# EAGLE design WSC2022SE_TP16_MA2_SPDIF_StartingPoint_ NO_RCA _JACK (EAGLE 9.7.0)

## Sheet 1 of 5
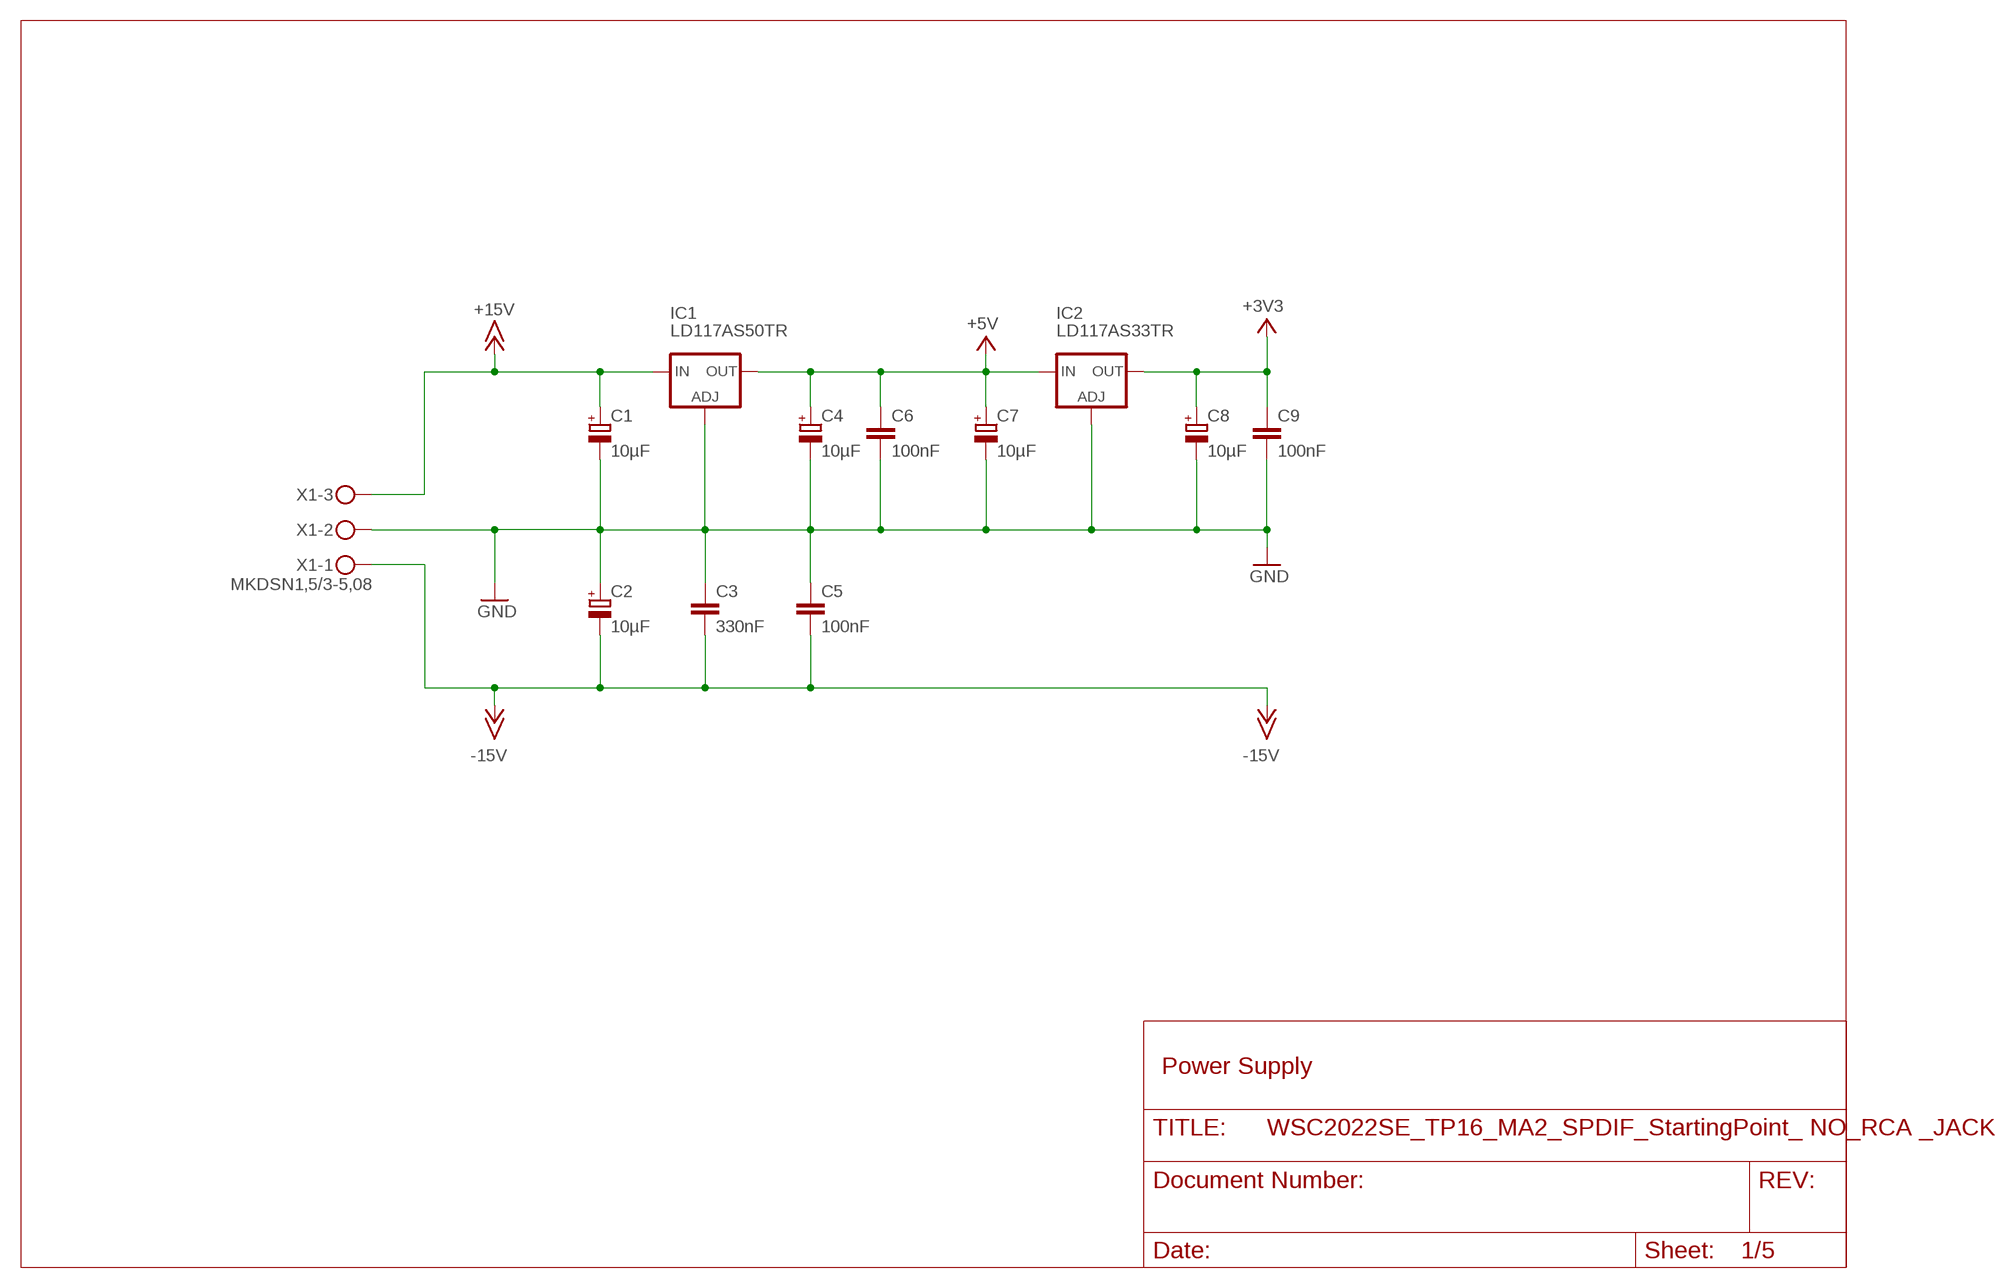
[diagram p0: schematic, sheet 1]

### Parts
C1  10µF  CPOL-EUCT3528  [CT3528]
C2  10µF  CPOL-EUCT3528  [CT3528]
C3  330nF  C-EUC0805  [C0805]
C4  10µF  CPOL-EUCT3528  [CT3528]
C5  100nF  C-EUC0805  [C0805]
C6  100nF  C-EUC0805  [C0805]
C7  10µF  CPOL-EUCT3528  [CT3528]
C8  10µF  CPOL-EUCT3528  [CT3528]
C9  100nF  C-EUC0805  [C0805]
IC1  LD117AS50TR  [SOT223]
IC2  LD117AS33TR  LD117AS50TR  [SOT223]
X1  MKDSN1,5/3-5,08  [MKDSN1,5/3-5,08]

### Nets
+3V3: C8.+ C9.1 IC2.2(OUT) IC2.4(OUT) ; also sheet 2,3
+5V: C4.+ C6.1 C7.+ IC1.2(OUT) IC1.4(OUT) IC2.3(IN) ; also sheet 3
+15V: C1.+ IC1.3(IN) X1.3 ; also sheet 4,5
-15V: C2.- C3.2 C5.2 X1.1 ; also sheet 4,5
GND: C1.- C2.+ C3.1 C4.- C5.1 C6.2 C7.- C8.- C9.2 IC1.1(ADJ) IC2.1(ADJ) X1.2 ; also sheet 2,3,4,5

### Notes on the sheet
- Power Supply

## Sheet 2 of 5
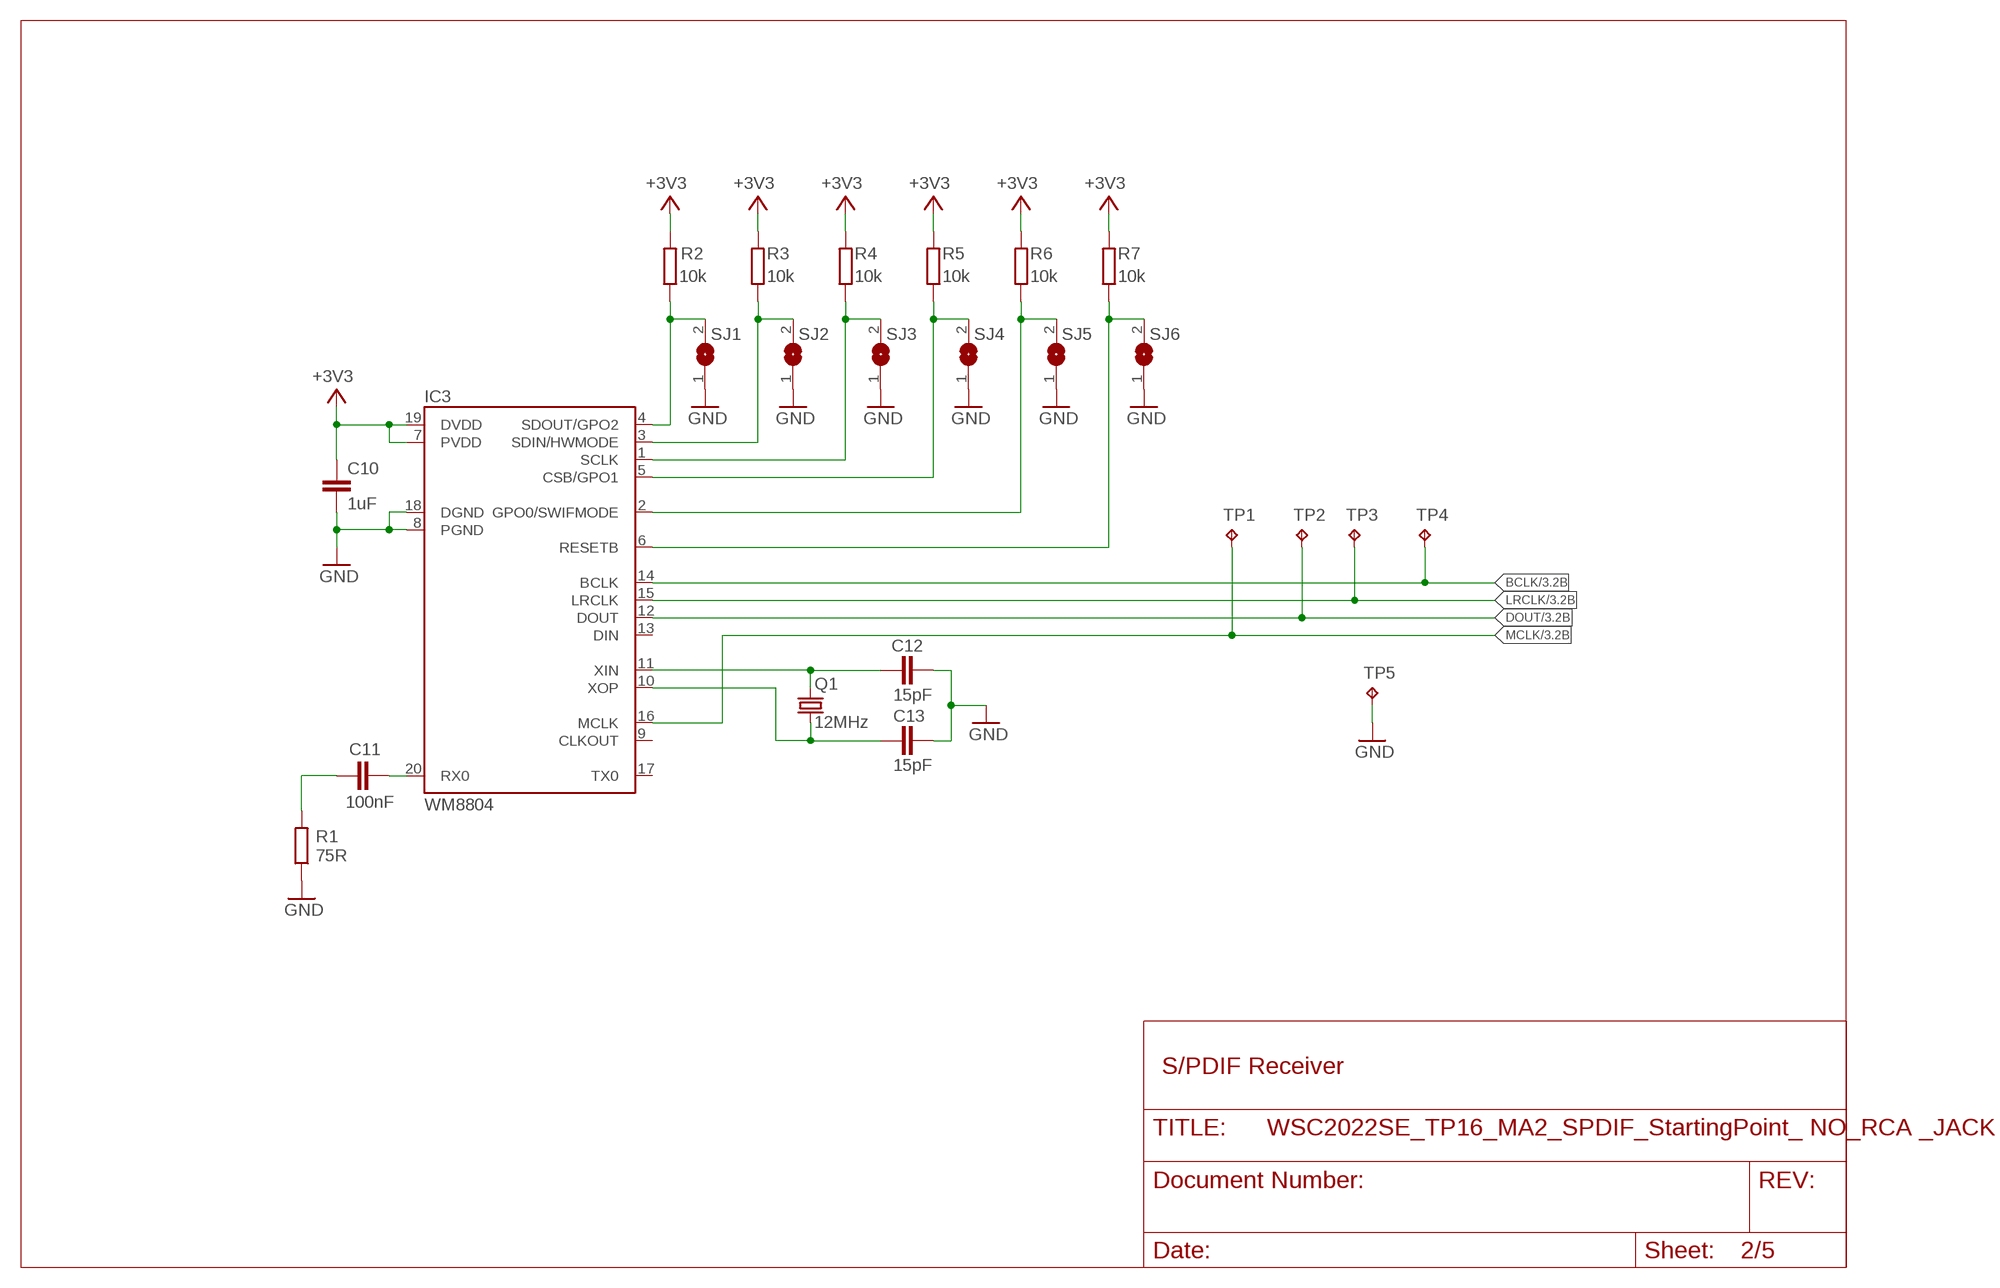
[diagram p1: schematic, sheet 2]

### Parts
C10  1uF  C-EUC0805  [C0805]
C11  100nF  C-EUC0805  [C0805]
C12  15pF  C-EUC0805  [C0805]
C13  15pF  C-EUC0805  [C0805]
IC3  WM8804  WM8804BU  [SSOP20BU]
Q1  12MHz  KX-9B  [5.0X3.2_2]
R1  75R  R-EU_R0805  [R0805]
R2  10k  R-EU_R0805  [R0805]
R3  10k  R-EU_R0805  [R0805]
R4  10k  R-EU_R0805  [R0805]
R5  10k  R-EU_R0805  [R0805]
R6  10k  R-EU_R0805  [R0805]
R7  10k  R-EU_R0805  [R0805]
SJ1  SJ  [SJ]
SJ2  SJ  [SJ]
SJ3  SJ  [SJ]
SJ4  SJ  [SJ]
SJ5  SJ  [SJ]
SJ6  SJ  [SJ]
TP1  TPB2,54  [B2,54]
TP2  TPB2,54  [B2,54]
TP3  TPB2,54  [B2,54]
TP4  TPB2,54  [B2,54]
TP5  TPB2,54  [B2,54]

### Nets
+3V3: C10.1 IC3.7(PVDD) IC3.19(DVDD) R2.2 R3.2 R4.2 R5.2 R6.2 R7.2 ; also sheet 1,3
BCLK: IC3.14(BCLK) TP4.TP ; also sheet 3
DOUT: IC3.12(DOUT) TP2.TP ; also sheet 3
GND: C10.2 C12.1 C13.1 IC3.8(PGND) IC3.18(DGND) R1.1 SJ1.1 SJ2.1 SJ3.1 SJ4.1 SJ5.1 SJ6.1 TP5.TP ; also sheet 1,3,4,5
LRCLK: IC3.15(LRCLK) TP3.TP ; also sheet 3
MCLK: IC3.16(MCLK) TP1.TP ; also sheet 3
N$39: C11.1 R1.2
N$40: C11.2 IC3.20(RX0)
N$43: C13.2 IC3.10(XOP) Q1.1
N$44: C12.2 IC3.11(XIN) Q1.2
N$45: IC3.4(SDOUT/GPO2) R2.1 SJ1.2
N$46: IC3.1(SCLK) R4.1 SJ3.2
N$47: IC3.2(GPO0/SWIFMODE) R6.1 SJ5.2
N$48: IC3.6(RESETB) R7.1 SJ6.2
N$51: IC3.5(CSB/GPO1) R5.1 SJ4.2
N$52: IC3.3(SDIN/HWMODE) R3.1 SJ2.2
Unconnected: IC3.9(CLKOUT) IC3.13(DIN) IC3.17(TX0)

### Notes on the sheet
- S/PDIF Receiver

## Sheet 3 of 5
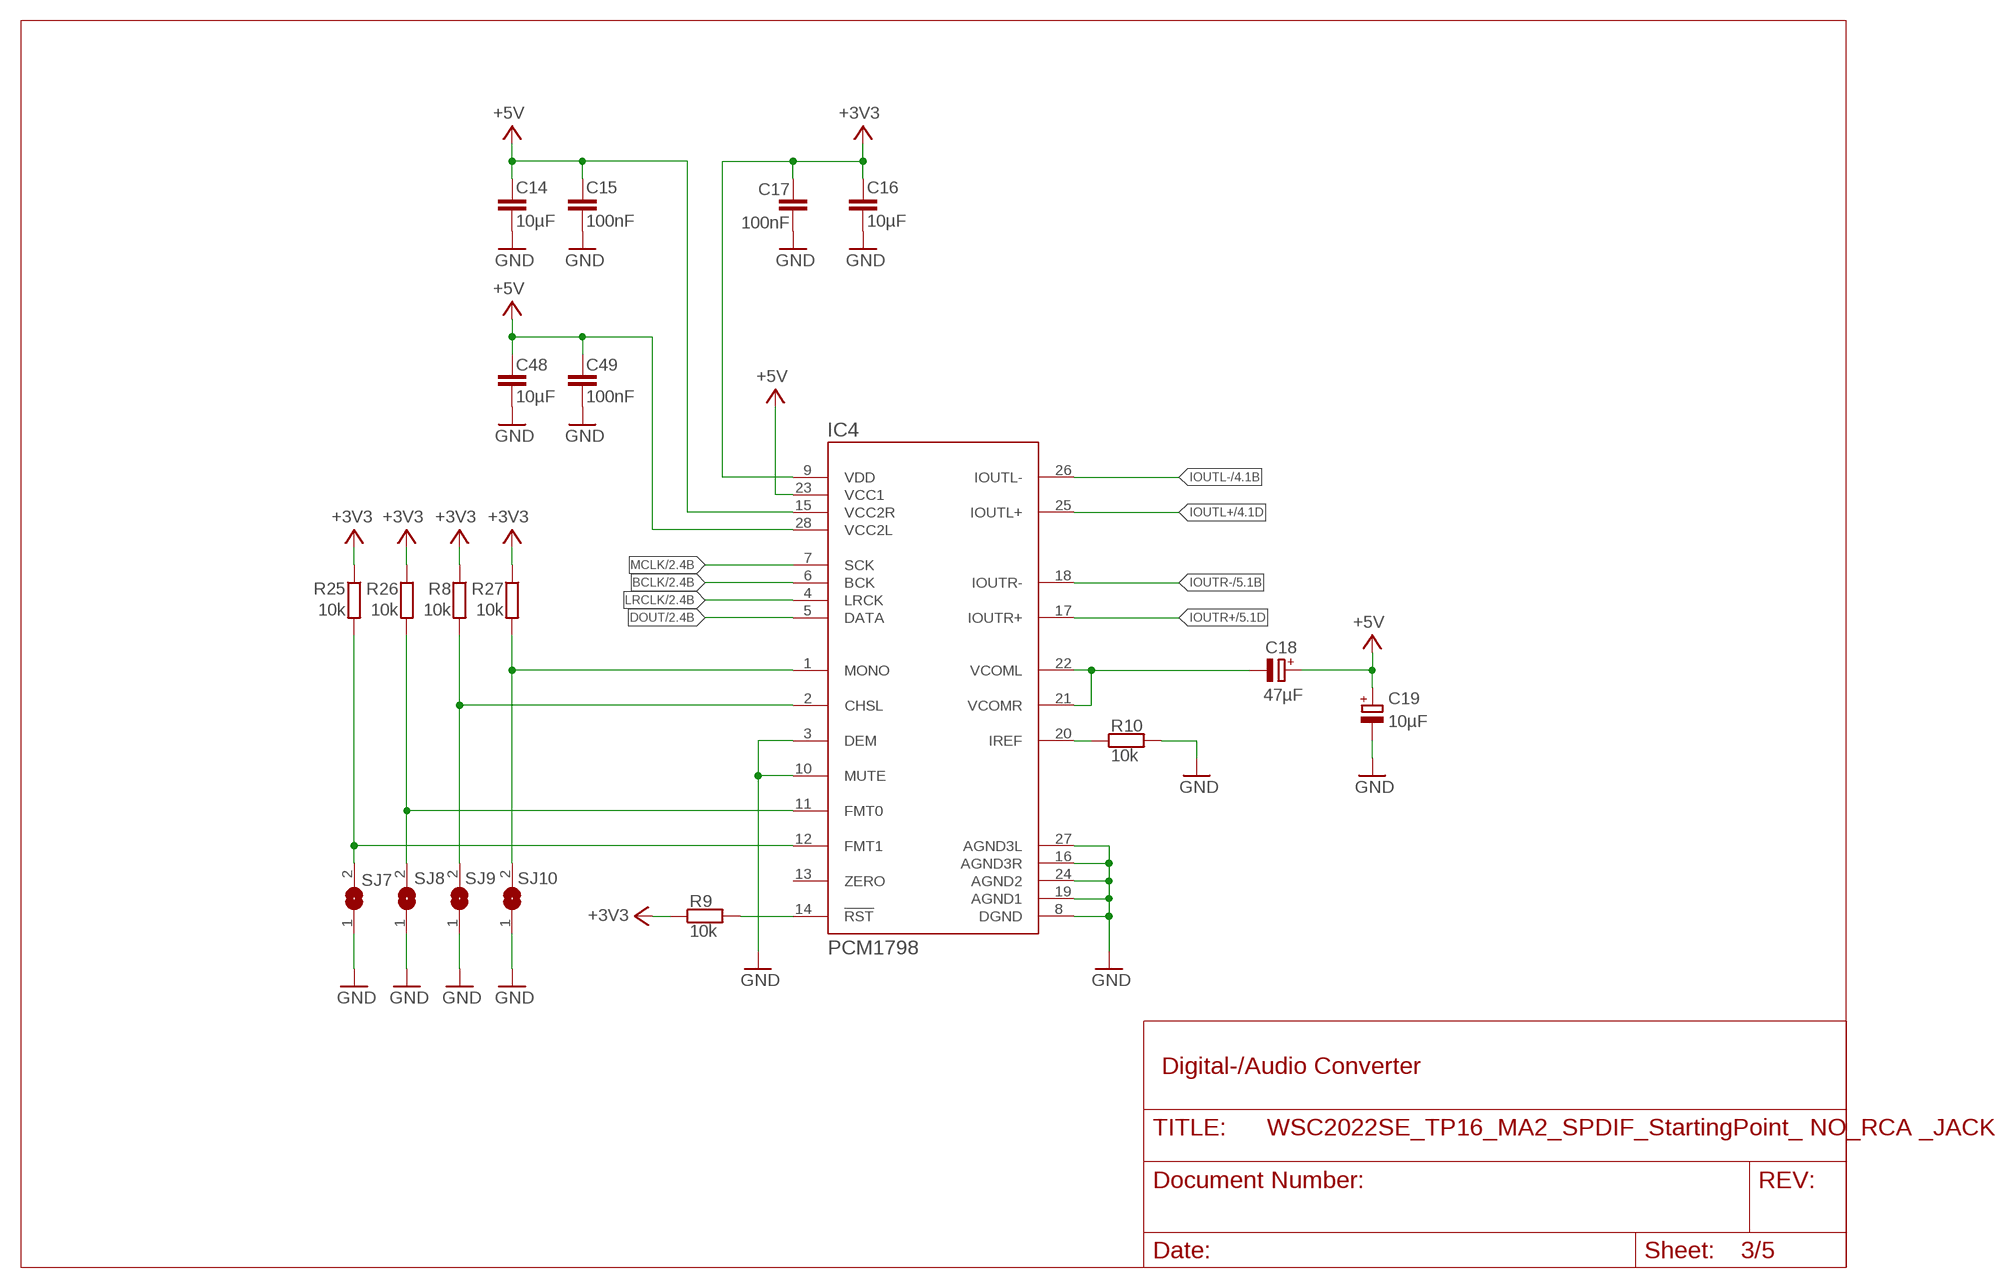
[diagram p2: schematic, sheet 3]

### Parts
C14  10µF  C-EUC0805  [C0805]
C15  100nF  C-EUC0805  [C0805]
C16  10µF  C-EUC0805  [C0805]
C17  100nF  C-EUC0805  [C0805]
C18  47µF  CPOL-EUC  [PANASONIC_C]
C19  10µF  CPOL-EUB  [PANASONIC_B]
C48  10µF  C-EUC0805  [C0805]
C49  100nF  C-EUC0805  [C0805]
IC4  PCM1798  [SSOP28]
R8  10k  R-EU_R0805  [R0805]
R9  10k  R-EU_R0805  [R0805]
R10  10k  R-EU_R0805  [R0805]
R25  10k  R-EU_R0805  [R0805]
R26  10k  R-EU_R0805  [R0805]
R27  10k  R-EU_R0805  [R0805]
SJ7  SJ  [SJ]
SJ8  SJ  [SJ]
SJ9  SJ  [SJ]
SJ10  SJ  [SJ]

### Nets
+3V3: C16.2 C17.2 IC4.9(VDD) R8.1 R9.1 R25.1 R26.1 R27.1 ; also sheet 1,2
+5V: C14.1 C15.1 C18.+ C19.+ C48.1 C49.1 IC4.15(VCC2R) IC4.23(VCC1) IC4.28(VCC2L) ; also sheet 1
BCLK: IC4.6(BCK) ; also sheet 2
DOUT: IC4.5(DATA) ; also sheet 2
GND: C14.2 C15.2 C16.1 C17.1 C19.- C48.2 C49.2 IC4.3(DEM) IC4.8(DGND) IC4.10(MUTE) IC4.16(AGND3R) IC4.19(AGND1) IC4.24(AGND2) IC4.27(AGND3L) R10.2 SJ7.1 SJ8.1 SJ9.1 SJ10.1 ; also sheet 1,2,4,5
IOUTL+: IC4.25(IOUTL+) ; also sheet 4
IOUTL-: IC4.26(IOUTL-) ; also sheet 4
IOUTR+: IC4.17(IOUTR+) ; also sheet 5
IOUTR-: IC4.18(IOUTR-) ; also sheet 5
LRCLK: IC4.4(LRCK) ; also sheet 2
MCLK: IC4.7(SCK) ; also sheet 2
N$1: IC4.1(MONO) R27.2 SJ10.2
N$6: IC4.14(!RST) R9.2
N$8: IC4.20(IREF) R10.1
N$9: C18.- IC4.21(VCOMR) IC4.22(VCOML)
N$11: IC4.11(FMT0) R26.2 SJ8.2
N$18: IC4.12(FMT1) R25.2 SJ7.2
N$21: IC4.2(CHSL) R8.2 SJ9.2
Unconnected: IC4.13(ZERO)

### Notes on the sheet
- Digital-/Audio Converter

## Sheet 4 of 5
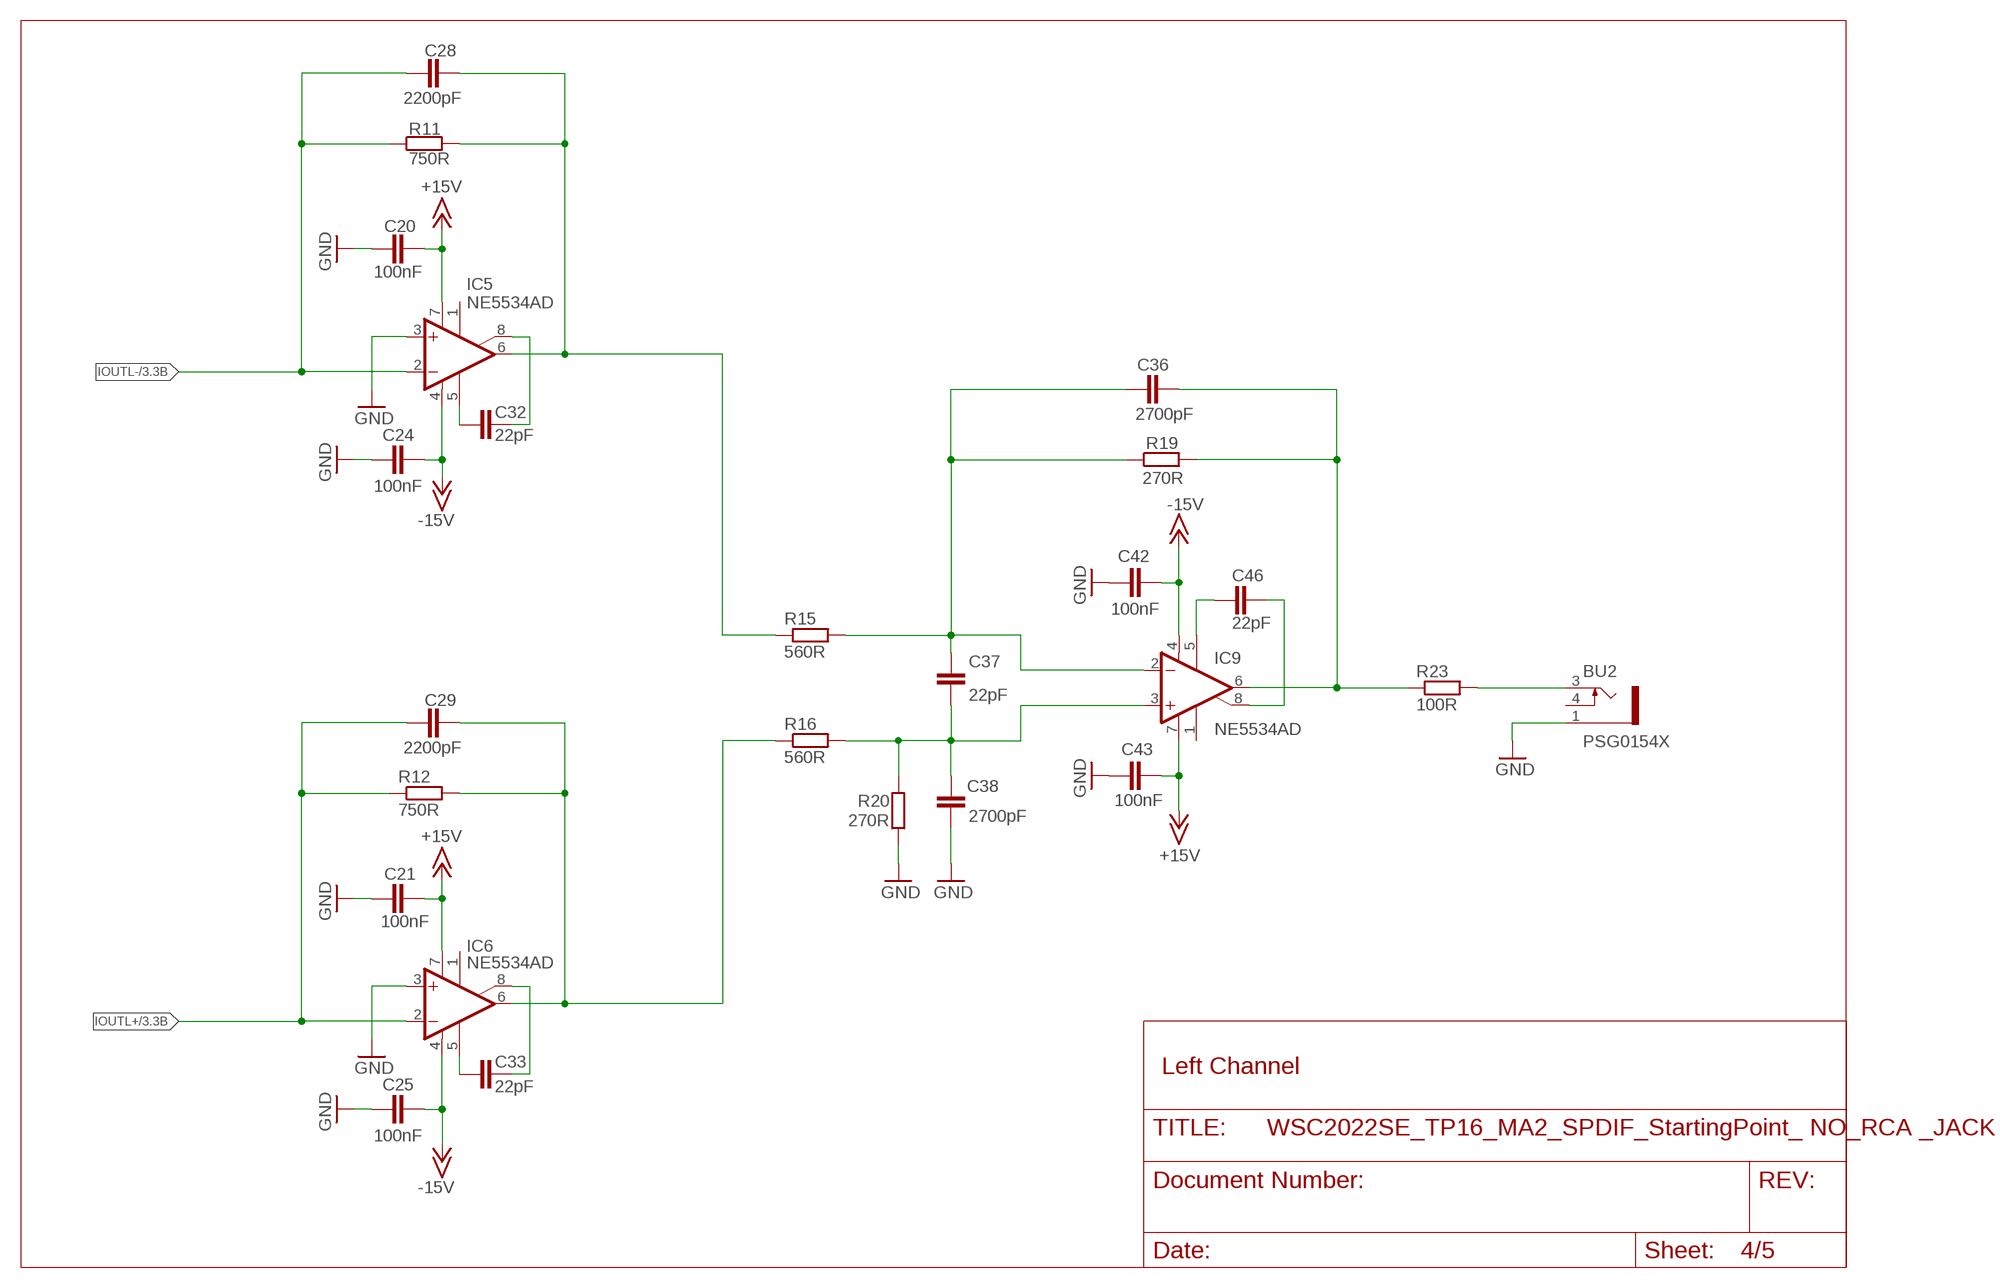
[diagram p3: schematic, sheet 4]

### Parts
BU2  PSG0154X  [PHONO-3P]
C20  100nF  C-EUC0805  [C0805]
C21  100nF  C-EUC0805  [C0805]
C24  100nF  C-EUC0805  [C0805]
C25  100nF  C-EUC0805  [C0805]
C28  2200pF  C-EUC0805  [C0805]
C29  2200pF  C-EUC0805  [C0805]
C32  22pF  C-EUC0805  [C0805]
C33  22pF  C-EUC0805  [C0805]
C36  2700pF  C-EUC0805  [C0805]
C37  22pF  C-EUC0805  [C0805]
C38  2700pF  C-EUC0805  [C0805]
C42  100nF  C-EUC0805  [C0805]
C43  100nF  C-EUC0805  [C0805]
C46  22pF  C-EUC0805  [C0805]
IC5  NE5534AD  [SO08]
IC6  NE5534AD  [SO08]
IC9  NE5534AD  [SO08]
R11  750R  R-EU_R0805  [R0805]
R12  750R  R-EU_R0805  [R0805]
R15  560R  R-EU_R0805  [R0805]
R16  560R  R-EU_R0805  [R0805]
R19  270R  R-EU_R0805  [R0805]
R20  270R  R-EU_R0805  [R0805]
R23  100R  R-EU_R0805  [R0805]

### Nets
+15V: C20.1 C21.1 C43.1 IC5.7(V+) IC6.7(V+) IC9.7(V+) ; also sheet 1,5
-15V: C24.1 C25.1 C42.1 IC5.4(V-) IC6.4(V-) IC9.4(V-) ; also sheet 1,5
GND: BU2.1 C20.2 C21.2 C24.2 C25.2 C38.2 C42.2 C43.2 IC5.3(+IN) IC6.3(+IN) R20.1 ; also sheet 1,2,3,5
IOUTL+: C29.1 IC6.2(-IN) R12.1 ; also sheet 3
IOUTL-: C28.1 IC5.2(-IN) R11.1 ; also sheet 3
N$2: C33.1 IC6.8(ON/CMP)
N$3: C33.2 IC6.5(CMP)
N$4: C37.2 C38.1 IC9.3(+IN) R16.2 R20.2
N$17: C32.2 IC5.5(CMP)
N$23: C32.1 IC5.8(ON/CMP)
N$28: C36.2 C37.1 IC9.2(-IN) R15.2 R19.1
N$30: C36.1 IC9.6(OUT) R19.2 R23.1
N$32: C46.1 IC9.5(CMP)
N$33: C46.2 IC9.8(ON/CMP)
OUT-CHANNEL-L: BU2.3 R23.2
VOUTL+: C29.2 IC6.6(OUT) R12.2 R16.1
VOUTL-: C28.2 IC5.6(OUT) R11.2 R15.1
Unconnected: BU2.4 IC5.1(ON) IC6.1(ON) IC9.1(ON)

### Notes on the sheet
- Left Channel

## Sheet 5 of 5
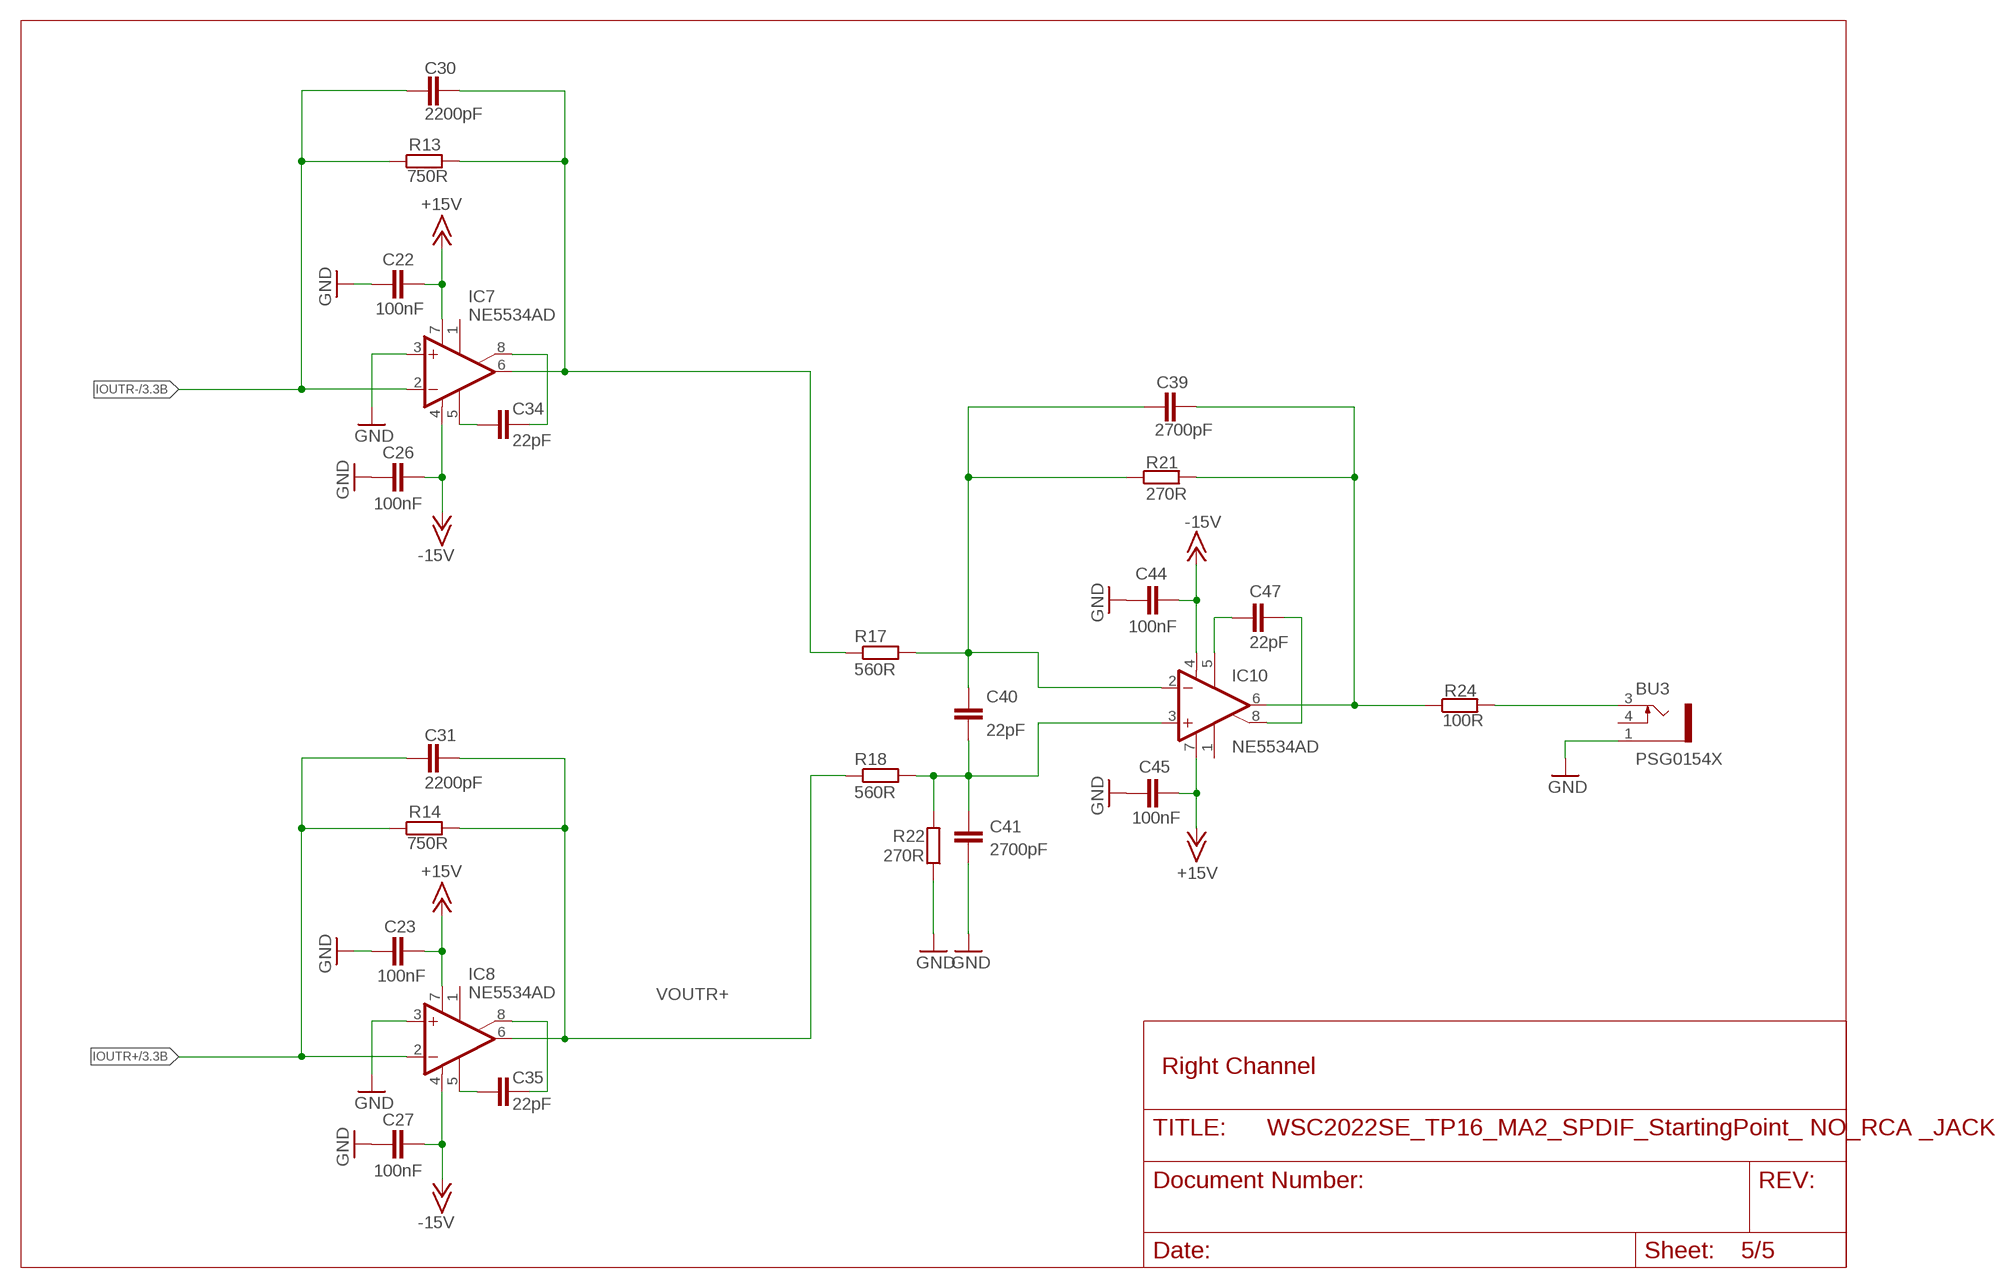
[diagram p4: schematic, sheet 5]

### Parts
BU3  PSG0154X  [PHONO-3P]
C22  100nF  C-EUC0805  [C0805]
C23  100nF  C-EUC0805  [C0805]
C26  100nF  C-EUC0805  [C0805]
C27  100nF  C-EUC0805  [C0805]
C30  2200pF  C-EUC0805  [C0805]
C31  2200pF  C-EUC0805  [C0805]
C34  22pF  C-EUC0805  [C0805]
C35  22pF  C-EUC0805  [C0805]
C39  2700pF  C-EUC0805  [C0805]
C40  22pF  C-EUC0805  [C0805]
C41  2700pF  C-EUC0805  [C0805]
C44  100nF  C-EUC0805  [C0805]
C45  100nF  C-EUC0805  [C0805]
C47  22pF  C-EUC0805  [C0805]
IC7  NE5534AD  [SO08]
IC8  NE5534AD  [SO08]
IC10  NE5534AD  [SO08]
R13  750R  R-EU_R0805  [R0805]
R14  750R  R-EU_R0805  [R0805]
R17  560R  R-EU_R0805  [R0805]
R18  560R  R-EU_R0805  [R0805]
R21  270R  R-EU_R0805  [R0805]
R22  270R  R-EU_R0805  [R0805]
R24  100R  R-EU_R0805  [R0805]

### Nets
+15V: C22.1 C23.1 C45.1 IC7.7(V+) IC8.7(V+) IC10.7(V+) ; also sheet 1,4
-15V: C26.1 C27.1 C44.1 IC7.4(V-) IC8.4(V-) IC10.4(V-) ; also sheet 1,4
GND: BU3.1 C22.2 C23.2 C26.2 C27.2 C41.2 C44.2 C45.2 IC7.3(+IN) IC8.3(+IN) R22.1 ; also sheet 1,2,3,4
IOUTR+: C31.1 IC8.2(-IN) R14.1 ; also sheet 3
IOUTR-: C30.1 IC7.2(-IN) R13.1 ; also sheet 3
N$5: C34.1 IC7.8(ON/CMP)
N$7: C39.2 C40.1 IC10.2(-IN) R17.2 R21.1
N$10: C39.1 IC10.6(OUT) R21.2 R24.1
N$12: C47.1 IC10.5(CMP)
N$13: C47.2 IC10.8(ON/CMP)
N$14: C34.2 IC7.5(CMP)
N$15: C40.2 C41.1 IC10.3(+IN) R18.2 R22.2
N$16: C35.1 IC8.8(ON/CMP)
N$22: C35.2 IC8.5(CMP)
OUT-CHANNEL-R: BU3.3 R24.2
VOUTR+: C31.2 IC8.6(OUT) R14.2 R18.1
VOUTR-: C30.2 IC7.6(OUT) R13.2 R17.1
Unconnected: BU3.4 IC7.1(ON) IC8.1(ON) IC10.1(ON)

### Notes on the sheet
- Right Channel

## Library data of the parts
BU2 BU3 = cinch:PSG0154X: PSG01546 ist eine 3-polige 8.3mm-Cinch-Buchse mit vergoldeten Kupferkontakten, einem Körper aus vergoldetem Kupfer und einer Abdeckung aus farbigem ABS zur Leiterplattenmontage.
C1 C2 C4 C7 C8 C18 C19 = rcl:CPOL-EU: POLARIZED CAPACITOR, European symbol; SPICEPREFIX: C
C3 C5 C6 C9-C17 C20-C49 = rcl:C-EU: CAPACITOR, European symbol; SPICEPREFIX: C
IC1 IC2 = v-reg2:LD117A?*: Low drop fixed and adjustable positive voltage regulators 1 A Source: http://www.st.com/stonline/products/literature/ds/7194/ld1117axx.pdf
IC3 = SPDIF-DAC-V10-20220816-2:WM8804: 1:1 Digital Interface Transceiver with PLL http://www.wolfsonmicro.com/documents/uploads/data_sheets/en/WM8804.pdf
IC4 = SPDIF-DAC-V10-20220816:PCM1798
IC5-IC10 = linear:NE5534: LOW-NOISE OPERATIONAL AMPLIFIER Source: http://focus.ti.com/lit/ds/symlink/ne5534.pdf
Q1 = crystal-geyer_V1_0:KX: Quartz Crystals (MHz) SMD: KX - Serie Model Size l/w/h [mm] Frequency Range Frequency Stability Temp. Range [°C] Load Capacitance AECQ 200 availabel Datasheet KX-4 KX-5 KX-6 KX-7 KX-9A KX-9B KX-12A KX-12B KX-13 KX-20 KX-K KX-KS 1.6/1.2/0.3 2.0/1.6/0.45 2.5/2.0/0.55 3.2/2.5/0.8 5.0/3.2/1.0 5.0/3.2/1.1 6.0/3.5/1.1 6.0/3.5/1.0 7.0/5.0 /1.3 11.6/5.5/1.6 12.3/4.5/4.2 12.3/4.5/3.2 24.0 ~ 80.0 MHz 16.0 ~ 80.0 MHz 12.0 ~ 80.0 MHz 8.0 ~ 60.0 MHz 7,68 ~ 300,0 MHz 8,0 ~ 50,0 MHz 8,0 ~ 150,0 MHz 8,0 ~ 50,0 MHz 6,0 ~ 160,0 MHz 3,579 ~ 25,0 MHz 3,579 ~ 70,0 MHz 3,579 ~ 70,0 MHz ±10 … ±50ppm ±10 … ±50ppm ±10 … ±50ppm ±10 … ±50ppm ±10 … ±50ppm ±10 … ±50ppm ±10 … ±50ppm ±10 … ±50ppm ±10 … ±50ppm ±50ppm ±10 … ±50ppm ±10 … ±50ppm (*) -40°C …+85°C (*) -40°C …+125°C (*) -40°C …+125°C (*) -40°C …+125°C (*) -40°C …+105°C (*) -40°C …+105°C (*) -40°C …+125°C (*) -40°C …+105°C (*) -40°C …+105°C (*) -40°C …+105°C (*) -40°C …+85°C (*) -40°C …+85°C 8, 8…16 8, 8…16 10, 8…16 12, 7…20 16, 10…20 16, 10…20 16, 10…20 16, 12…20 16, 12…20 16, 12…20 16, 12…30 16, 12…30 - yes yes yes - - - - - - - - KX-4.pdf <http://www.geyer-electronic.de/uploads/tx_userartikelfrequenz/GEYER-KX-4.pdf> KX-5.pdf <http://www.geyer-electronic.de/uploads/tx_userartikelfrequenz/GEYER-KX-5.pdf> KX-6.pdf <http://www.geyer-electronic.de/uploads/tx_userartikelfrequenz/GEYER-KX-6.pdf> KX-7.pdf <http://www.geyer-electronic.de/uploads/tx_userartikelfrequenz/GEYER-KX-7.pdf> KX-9A.pdf <http://www.geyer-electronic.de/uploads/tx_userartikelfrequenz/GEYER-KX-9A.pdf> KX-9B.pdf <http://www.geyer-electronic.de/uploads/tx_userartikelfrequenz/GEYER-KX-9B.pdf> KX-12A.pdf <http://www.geyer-electronic.de/uploads/tx_userartikelfrequenz/GEYER-KX-12A.pdf> KX-12B.pdf <http://www.geyer-electronic.de/uploads/tx_userartikelfrequenz/GEYER-KX-12B.pdf> KX-13.pdf <http://www.geyer-electronic.de/uploads/tx_userartikelfrequenz/GEYER-KX-13.pdf> KX-20.pdf <http://www.geyer-electronic.de/uploads/tx_userartikelfrequenz/GEYER-KX-20.pdf> KX-K.pdf <http://www.geyer-electronic.de/uploads/tx_userartikelfrequenz/GEYER-KX-K.pdf> KX-KS.pdf <http://www.geyer-electronic.de/uploads/tx_userartikelfrequenz/GEYER-KX-KS.pdf> <http://www.geyer-electronic.de/fileadmin/template/img/logo-geyer-electronic.png> Details see: http://www.geyer-electronic.de/Frequenz-Produkte.9.0.html Created 2016-06-07, Hans Locher 2016 (C) Geyer Quartz Technology KX4,KX5,KX6,KX7,KX9A,KX9B,KX12A,KX12B,KX13,KX20,KXK,KXKS;1612;2016;2520;3225;5032;6035;7050;11655;12345;1,6x1,2;2,0x1,6;2,5x2,0;3,2x2,5;5,0x3,2;6,0x3,5;7,0x5,0;11,6x5,5;12,3x4,5;12,3x4,5;1.6x1.2;2.0x1.6;2.5x2.0;3.2x2.5;5.0x3.2;6.0x3.5;7.0x5.0;11.6x5.5;12.3x4.5;12.3x4.5;
R1-R27 = rcl:R-EU_: RESISTOR, European symbol; SPICEPREFIX: R
SJ1-SJ10 = jumper:SJ: SMD solder JUMPER
TP1-TP5 = testpad:TP: Test pad
X1 = con-phoenix-508:MKDSN1,5/3-5,08: MKDSN 1,5/ 3-5,08 Printklemme Nennstrom: 13,5 A Nennspannung: 250 V Rastermaß: 5,08 mm Polzahl: 3 Anschlussart: Schraubanschluss Montage: Löten Anschlussrichtung Leiter/Platine: 0 ° Artikelnummer: 1729131 Source: http://eshop.phoenixcontact.com .. 1729131.pdf

## Net classes
1 diff pairs: width 0.508 mm

## Board
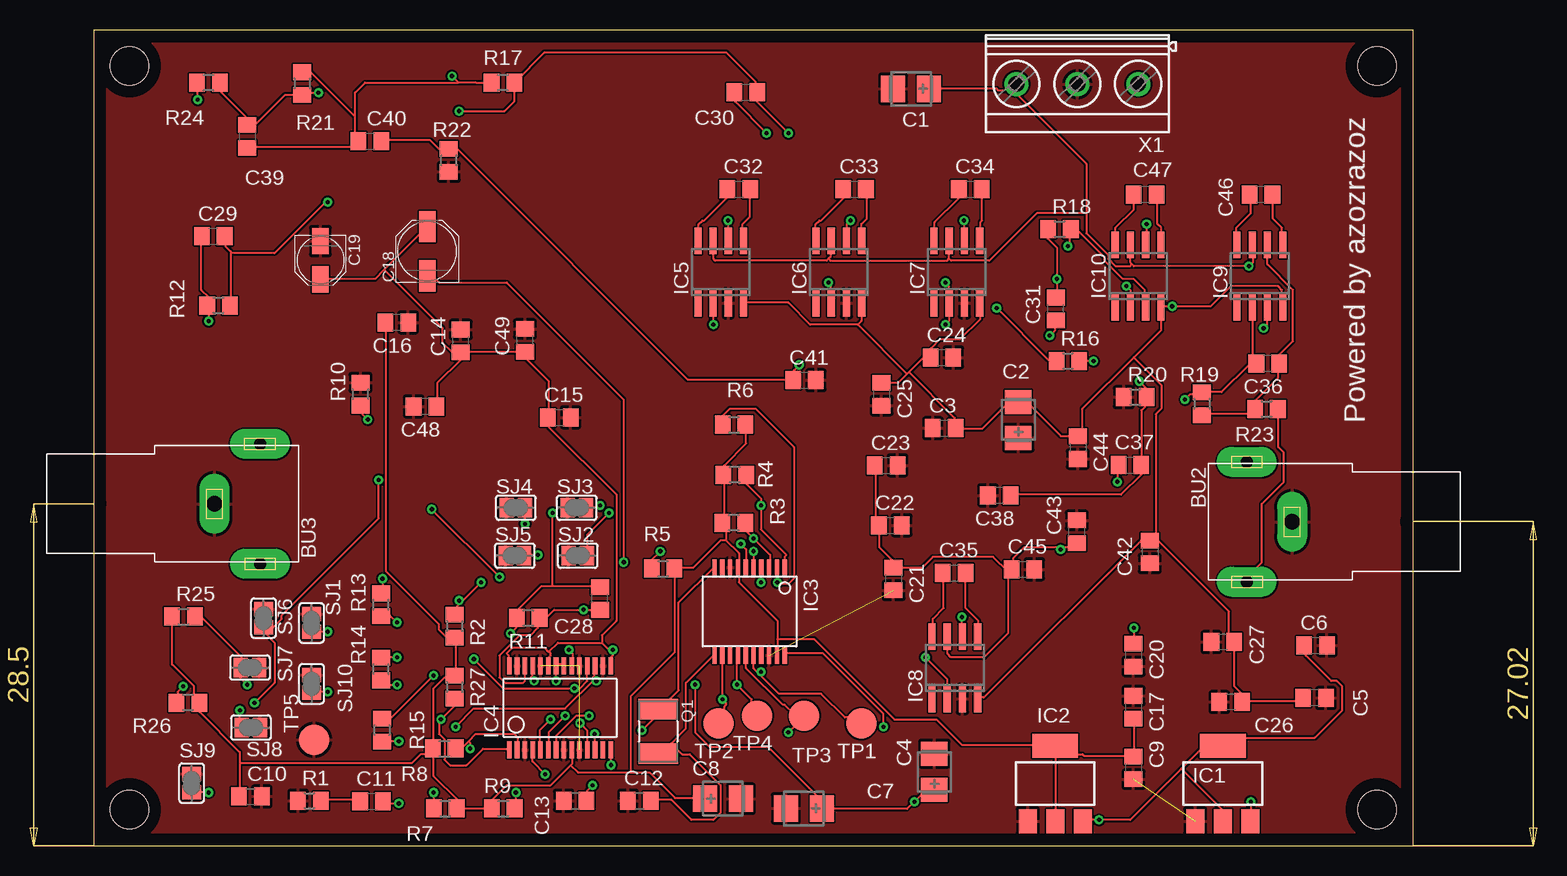
[diagram p5: board, top side]
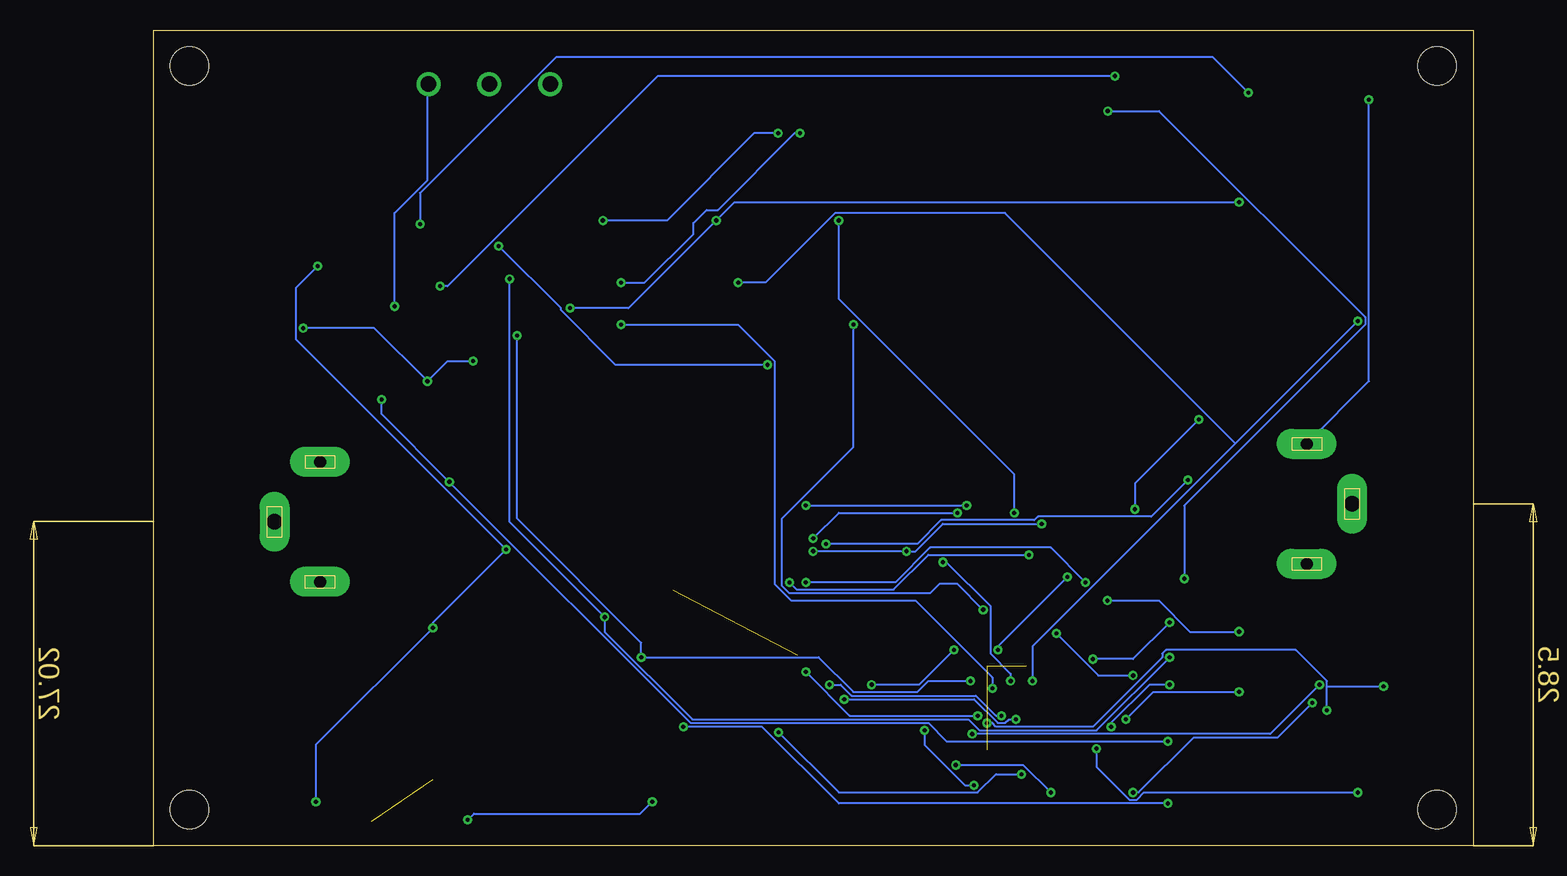
[diagram p6: board, bottom side, seen from below]

Size 110 x 68 mm. Coordinates in mm from the lower left corner, seen from the top.
Outline: 0,0 110,0 110,68 0,68 0,0
Copper layers (1*16): Top 0.035mm / dielectric 1.5mm / Bottom 0.035mm
Design rules "default": minimum track width 6mil, minimum drill 0.35mm, track to track 6mil, track to pad 6mil, pad to pad 6mil, via to via 6mil, smd to smd 6mil, copper to edge 40mil, drill to drill 6mil, minimum pad ring 10mil, minimum via ring 8mil, stop-mask expansion 4mil, vias tented up to drill 0mil, thermal gap 10mil
Holes 3.2 mm at 3,65 107,65 107,3 3,3

### Footprints (pad centres in the part's own frame; a part is rotated, then mirrored left to right if it is on the bottom)
PHONO-3P = drill 1.3 pad 2.5 long: 1 0,-5 | drill 1 pad 2.5 long: 3 5,-8.8; 4 -5,-8.8
CT3528 = smd 2 x 2.2: + -1.5,0; - 1.5,0
C0805 = smd 1.3 x 1.5: 1 -0.95,0; 2 0.95,0
PANASONIC_C = smd 2.6 x 1.4: + 2.05,0; - -2.05,0
PANASONIC_B = smd 2.2 x 1.4: + 1.6,0; - -1.6,0
SOT223 = smd 1.5 x 2: 1 -2.3,-3.15; 2 0,-3.15; 3 2.3,-3.15 | smd 3.8 x 2: 4 0,3.15
SSOP20BU = smd 0.348 x 1.397: 1 -2.925,-3.656; 2 -2.275,-3.656; 3 -1.625,-3.656; 4 -0.975,-3.656; 5 -0.325,-3.656; 6 0.325,-3.656; 7 0.975,-3.656; 8 1.625,-3.656; 9 2.275,-3.656; 10 2.925,-3.656; 11 2.925,3.656; 12 2.275,3.656; 13 1.625,3.656; 14 0.975,3.656; 15 0.325,3.656; 16 -0.325,3.656; 17 -0.975,3.656; 18 -1.625,3.656; 19 -2.275,3.656; 20 -2.925,3.656
SSOP28 = smd 0.38 x 1.4: 1 -4.225,-3.5; 2 -3.575,-3.5; 3 -2.925,-3.5; 4 -2.275,-3.5; 5 -1.625,-3.5; 6 -0.975,-3.5; 7 -0.325,-3.5; 8 0.325,-3.5; 9 0.975,-3.5; 10 1.625,-3.5; 11 2.275,-3.5; 12 2.925,-3.5; 13 3.575,-3.5; 14 4.225,-3.5; 15 4.225,3.5; 16 3.575,3.5; 17 2.925,3.5; 18 2.275,3.5; 19 1.625,3.5; 20 0.975,3.5; 21 0.325,3.5; 22 -0.325,3.5; 23 -0.975,3.5; 24 -1.625,3.5; 25 -2.275,3.5; 26 -2.925,3.5; 27 -3.575,3.5; 28 -4.225,3.5
SO08 = smd 0.6 x 2.2: 1 -1.905,-2.6; 2 -0.635,-2.6; 3 0.635,-2.6; 4 1.905,-2.6; 5 1.905,2.6; 6 0.635,2.6; 7 -0.635,2.6; 8 -1.905,2.6
5.0X3.2_2 = smd 1.7 x 3.3: 1 -1.85,0; 2 1.85,0
R0805 = smd 1.3 x 1.5: 1 -0.95,0; 2 0.95,0
SJ = smd 1.168 x 1.6: 1 -0.762,0; 2 0.762,0
B2,54 = smd 2.54 x 2.54: TP 0,0
MKDSN1,5/3-5,08 = drill 1.3 pad 2: 1 -7.641,0.025; 2 -2.561,0.025; 3 2.519,0.025

### Placement (x,y rotation side)
BU2  104.92,27 270 top
BU3  5.08,28.5 90 top
C1  68.15,63.09 180 top
C2  77.09,35.5 90 top
C3  70.91,34.8 0 top
C4  70.09,6.15 90 top
C5  101.78,12.31 180 top
C6  101.87,16.69 0 top
C7  59.2,3.09 180 top
C8  52.45,3.91 0 top
C9  86.69,6.48 270 top
C10  13.07,4.09 0 top
C11  23.17,3.69 0 top
C12  45.49,3.74 0 top
C13  40.14,3.74 0 top
C14  30.61,42.07 90 top
C15  38.82,35.69 0 top
C16  25.28,43.61 180 top
C17  86.69,11.53 270 top
C18  27.82,49.55 90 top
C19  18.91,48.8 270 top
C20  86.69,15.88 270 top
C21  66.69,22.23 270 top
C22  66.42,26.69 0 top
C23  66.07,31.69 0 top
C24  70.72,40.69 0 top
C25  65.69,37.63 270 top
C26  94.78,11.96 180 top
C27  94.13,16.96 180 top
C28  42.2,20.6 90 top
C29  9.98,50.8 0 top
C30  54.36,62.8 0 top
C31  80.2,44.74 90 top
C32  53.79,54.74 0 top
C33  63.44,54.74 0 top
C34  73.09,54.74 0 top
C35  71.74,22.74 0 top
C36  97.88,40.2 180 top
C37  86.39,31.74 0 top
C38  75.5,29.2 180 top
C39  12.8,59.12 270 top
C40  23.04,58.74 0 top
C41  59.26,38.8 0 top
C42  88.04,24.48 270 top
C43  81.96,26.17 90 top
C44  82.04,33.18 270 top
C45  77.47,23.04 0 top
C46  97.31,54.26 180 top
C47  87.66,54.26 180 top
C48  27.63,36.61 180 top
C49  35.96,42.12 90 top
IC1  94.14,5.18 0 top
IC2  80.17,5.18 0 top
IC3  54.69,19.52 180 top
IC4  38.88,11.48 0 top
IC5  52.28,47.81 0 top
IC6  62.12,47.81 0 top
IC7  71.96,47.81 0 top
IC8  71.8,14.81 0 top
IC9  97.22,47.48 0 top
IC10  87.06,47.48 0 top
Q1  47.07,9.51 270 top
R1  17.99,3.74 0 top
R2  30.09,18.29 270 top
R3  53.37,26.91 180 top
R4  53.45,30.91 180 top
R5  47.47,23.09 0 top
R6  53.39,35.09 0 top
R7  29.31,3.09 0 top
R8  29.23,8.09 0 top
R9  34.15,3.09 0 top
R10  22.26,37.64 90 top
R11  36.23,18.96 180 top
R12  10.42,45.04 0 top
R13  23.96,20.07 90 top
R14  23.96,14.72 90 top
R15  24.04,9.63 270 top
R16  81.22,40.39 0 top
R17  34.13,63.61 180 top
R18  80.52,51.39 0 top
R19  92.39,36.83 270 top
R20  86.82,37.39 0 top
R21  17.39,63.53 270 top
R22  29.61,57.12 90 top
R23  97.77,36.39 0 top
R24  9.58,63.61 180 top
R25  7.49,19.09 0 top
R26  7.86,11.91 180 top
R27  30.09,13.21 270 top
SJ1  18.17,18.56 270 top
SJ2  40.36,24.17 0 top
SJ3  40.28,28.17 0 top
SJ4  35.2,28.17 0 top
SJ5  35.12,24.17 0 top
SJ6  14.17,18.96 270 top
SJ7  13.04,14.83 180 top
SJ8  13.12,9.83 180 top
SJ9  8.17,5.2 270 top
SJ10  18.17,13.48 270 top
TP1  64.01,10.18 180 top
TP2  52.09,10.18 180 top
TP3  59.24,10.83 180 top
TP4  55.32,10.83 180 top
TP5  18.4,8.83 180 top
X1  79.45,63.52 180 top

### Tracks (layer width: path | path; a pad name or v marks a point on that pad's centre or on a via)
+3V3
  Top 0.152: C17.2 86.72,10.52 86.72,7.47 C9.1 86.56,7.47 82.6,7.47 82.45,7.62 80.16,7.62 | 80.16,7.62 80.16,8.23 IC2.4 | 80.16,7.62 80.16,2.13 IC2.2 | 80.16,7.62 IC2.4 | 52.73,25.45 53.8,24.38 53.8,23.32 IC3.7 53.8,23.16 53.8,21.95 57,18.75 57,17.22 | 52.73,25.45 52.73,26.52 52.43,26.82 R3.2 52.43,26.98 52.58,27.13 52.58,30.79 R4.2 52.58,30.94 52.58,31.7 54.41,33.53 54.41,35.05 R6.2 | 57,17.22 57,16 IC3.19 | 52.73,25.45 52.27,25.45 49.99,23.16 48.46,23.16 R5.2 48.46,23.01 48.46,16.15 44.81,12.5 44.81,6.1 | 57,17.22 60.05,17.22 66.75,10.52 70.26,10.52 72.39,8.38 80.16,8.38 IC2.4 | C16.2 24.38,43.59 24.38,22.86 28.8,18.44 28.8,17.98 29.41,17.37 30.02,17.37 R2.2 30.18,17.22 30.18,14.17 R27.1 30.02,14.02 29.26,14.02 28.35,13.11 28.35,8.23 R8.1 | 12.19,6.86 12.19,7.77 8.84,11.12 8.84,11.89 R26.1 8.69,12.04 8.38,12.34 8.38,13.26 6.55,15.09 6.55,19.05 R25.1 | 12.19,6.86 12.19,4.12 C10.1 | 39.78,6.71 38.1,5.03 34.44,5.03 33.22,3.81 33.22,3.2 R9.1 33.07,3.05 30.33,3.05 R7.2 30.33,3.2 30.33,3.81 28.35,5.79 28.35,7.62 | 39.78,6.71 39.93,6.86 39.93,7.92 IC4.9 | 28.35,7.62 28.35,8.08 R8.1 | 44.81,6.1 40.39,6.1 39.78,6.71 | 44.81,6.1 46.33,6.1 48.46,3.96 50.9,3.96 C8.+ | 12.19,6.86 26.52,6.86 27.28,7.62 28.35,7.62 | 28.35,7.62 R8.1
+5V  (via drill 0.35)
  Top 0.152: C4.+ 69.95,4.57 69.34,4.57 v68.43,3.66 67.82,3.05 60.81,3.05 C7.+ 60.66,3.2 60.66,3.81 56.24,8.23 51.36,8.23 50.14,9.45 v50.14,13.41 | C6.1 101.04,16.61 101.04,15.85 103.17,13.72 103.63,13.72 104.09,13.26 104.09,11.28 101.8,8.99 94.79,8.99 94.18,8.38 IC1.4 94.03,8.23 92.51,8.23 90.68,6.4 | 90.68,6.4 86.41,2.13 v83.82,2.13 82.6,2.13 IC2.3 | 90.68,6.4 94.03,3.05 94.03,2.13 IC1.2 | 24.23,48.01 27.74,51.51 C18.+ | 24.23,48.01 23.47,47.24 19.05,47.24 C19.+ | 37.95,16.15 38.1,16 38.1,15.85 37.95,15.7 37.95,15.09 IC4.23 | 37.95,16.15 37.64,16.46 34.9,16.46 34.44,16 34.59,15.85 34.59,15.09 IC4.28 | 42.37,16.92 43.13,16.15 | 43.13,16.15 43.28,16 43.28,15.85 43.13,15.7 43.13,15.09 IC4.15 | 42.37,16.92 38.71,16.92 37.95,16.15 | C48.1 28.65,36.73 28.65,38.56 30.63,40.54 30.63,41 C14.1 | C14.1 30.63,41.15 35.81,41.15 C49.1 35.97,41.15 35.97,40.69 37.95,38.71 37.95,35.81 C15.1 37.95,35.66 37.95,34.9 43.59,29.26 43.59,18.75 42.37,17.53 42.37,16.92 | 24.23,48.01 29.11,43.13 29.11,41.91 29.87,41.15 30.48,41.15 C14.1 | 43.13,16.15 v43.28,16.31
  Bottom 0.152: v68.43,3.66 69.43,2.66 83.3,2.66 v83.82,2.13 | v50.14,13.41 46.18,13.41 v43.28,16.31
+15V  (via drill 0.35)
  Top 0.152: C23.1 65.23,31.55 65.23,26.98 65.38,26.82 C22.1 65.53,26.67 65.53,24.84 66.6,23.77 66.6,23.32 C21.1 66.75,23.16 69.04,23.16 69.95,24.08 74.98,24.08 76.2,22.86 76.35,22.86 | 80.62,24.84 81.53,24.84 81.84,25.15 C43.1 | 80.62,24.84 77.57,24.84 76.66,23.93 76.66,23.16 C45.1 | v86.72,18.14 86.72,16.92 C20.1 | 80.62,24.84 v80.62,24.69 | v96.47,3.66 96.47,2.13 IC1.3 | 76.35,22.86 76.5,23.01 C45.1 | 76.35,22.86 76.2,22.71 76.2,17.68 74.22,15.7 71.48,15.7 71.17,16 71.17,17.37 IC8.7 | 76.35,22.86 C45.1 | 61.27,48.92 61.42,49.07 61.42,50.29 IC6.7 | 61.27,48.92 61.11,48.77 51.82,48.77 51.66,48.92 51.66,50.29 IC5.7 | 71.32,48.92 71.32,50.29 IC7.7 | 71.32,48.92 71.17,48.77 61.42,48.77 61.27,48.92 | 86.56,48.46 86.72,48.31 v96.32,48.31 96.62,48.62 96.62,49.99 IC9.7 | 86.56,48.46 86.41,48.62 86.41,49.99 IC10.7 | C1.+ 69.8,63.09 75.29,63.09 75.44,62.94 75.89,62.94 76.35,63.4 76.81,63.4 X1.3 76.96,63.4 76.96,62.64 82.75,56.84 82.75,52.73 | 86.56,48.46 86.41,48.31 85.19,48.31 84.58,48.92 84.58,49.23 82.75,51.05 82.75,52.73 | 71.32,48.92 71.48,48.77 74.68,48.77 78.64,52.73 82.75,52.73
  Bottom 0.152: v96.47,3.66 96.47,8.38 v86.72,18.14 86.72,18.59 v80.62,24.69 98.15,42.22 98.15,46.48 v96.32,48.31
-15V  (via drill 0.35)
  Top 0.152: C5.2 100.74,12.19 100.58,12.04 95.86,12.04 C26.1 95.71,12.04 95.71,12.65 95.1,13.26 95.1,16.92 C27.1 94.94,17.07 94.64,17.37 94.64,19.51 88.85,25.3 88.54,25.3 | 88.54,25.3 88.09,25.3 C42.1 | IC8.4 73.76,12.34 74.22,12.34 87.33,25.45 87.94,25.45 C42.1 | IC9.4 99.06,44.96 99.06,46.33 98.75,46.63 94.79,46.63 93.12,44.96 v89.92,44.96 89,44.96 IC10.4 89,44.81 89,42.98 86.72,40.69 | 63.7,43.43 59.74,43.43 57.91,45.26 54.25,45.26 IC5.4 | 63.7,43.43 64.01,43.74 64.01,45.11 IC6.4 | 67.97,39.47 69.19,40.69 69.65,40.69 C24.1 69.8,40.69 69.8,41.45 70.56,42.22 72.24,42.22 73.91,43.89 73.91,45.11 IC7.4 | 67.97,39.47 67.82,39.32 | 67.82,39.32 67.06,38.56 65.84,38.56 C25.1 | 67.82,39.32 63.7,43.43 | 67.97,39.47 71.78,35.66 71.78,34.9 C3.2 71.93,34.75 74.07,34.75 76.2,36.88 76.96,36.88 C2.- 77.11,36.88 77.88,36.88 80.62,34.14 81.99,34.14 C44.1 82.14,34.14 82.45,34.44 82.45,36.42 86.72,40.69 | 88.54,25.3 88.54,35.97 89,36.42 89,38.41 86.72,40.69 | 88.54,25.3 C42.1
  Bottom 0.152: v89.92,44.96 89.92,52.73 87.17,55.47 87.17,63.4 X1.1
BCLK  (via drill 0.35)
  Top 0.152: IC3.14 53.65,15.85 v53.65,13.41 54.86,12.19 54.86,11.28 55.17,10.97 TP4.TP | v39.32,10.82 37.95,9.45 37.95,8.08 IC4.6
  Bottom 0.152: v39.32,10.82 39.78,10.82 41.45,12.5 51.82,12.5 52.73,13.41 v53.65,13.41
DOUT  (via drill 0.35)
  Top 0.152: IC3.12 52.43,15.85 v52.43,12.19 52.73,11.89 52.73,11.73 52.58,11.58 52.58,11.43 52.12,10.97 52.12,10.21 TP2.TP | v38.1,10.52 37.19,9.6 37.19,8.08 IC4.5
  Bottom 0.152: v38.1,10.52 38.71,10.52 39.01,10.21 39.62,10.21 41.6,12.19 v52.43,12.19
GND  (4 unrouted)
  pour Top: -5,70 -5,-5 115,-5 115,70
IOUTL+  (via drill 0.35)
  Top 0.152: v36.73,13.72 36.42,14.02 36.58,14.17 36.58,14.94 IC4.25 | v9.6,43.74 9.6,44.96 R12.1 9.6,45.11 9.6,45.72 8.99,46.33 8.99,50.75 C29.1 | v61.27,46.94 61.42,46.79 61.42,45.26 IC6.2
  Bottom 0.152: v36.73,13.72 36.73,16.61 19.81,33.53 | v9.6,43.74 19.81,33.53 | v61.27,46.94 58.98,46.94 53.19,52.73 39.01,52.73 19.81,33.53
IOUTL-  (via drill 0.35)
  Top 0.152: IC4.26 35.97,14.94 35.97,13.72 35.81,13.56 34.29,13.56 33.83,14.02 33.83,15.85 35.51,17.53 36.42,17.53 37.03,18.14 37.03,18.9 R11.1 37.19,19.05 37.8,19.05 38.41,19.66 v40.84,19.66 42.06,19.66 C28.1 | v51.66,43.43 51.66,45.11 IC5.2
  Bottom 0.152: v51.66,43.43 51.66,33.22 57.61,27.28 57.61,21.64 57,21.03 45.26,21.03 44.5,21.79 42.98,21.79 v40.84,19.66
IOUTR+  (via drill 0.35)
  Top 0.152: 41.76,13.87 41.6,14.02 41.76,14.17 41.76,14.94 IC4.17 | 41.76,13.87 39.32,11.43 31.7,11.43 v30.18,9.91 | v25.3,13.41 24.38,13.41 24.08,13.72 R14.1 | v79.7,42.52 80.16,42.98 80.16,43.74 C31.1 | v69.34,15.7 71.17,13.87 71.17,12.34 IC8.2 | v41.91,13.72 41.76,13.87
  Bottom 0.152: v30.18,9.91 30.18,10.21 26.98,13.41 v25.3,13.41 | v79.7,42.52 79.7,27.28 69.34,16.92 v69.34,15.7 54.56,15.7 51.66,12.8 46.33,12.8 45.41,13.72 v41.91,13.72
IOUTR-  (via drill 0.35)
  Top 0.152: v31.7,15.54 34.14,13.11 v40.08,13.11 40.54,13.11 41.15,13.72 41.15,14.94 IC4.18 | v25.3,18.59 24.69,19.2 24.08,19.2 R13.1 | v56.1,59.4 53.49,62.01 53.49,62.77 C30.1 | v71.02,46.94 71.32,46.63 71.32,45.26 IC7.2 71.32,45.11 71.32,43.74 v71.02,43.43
  Bottom 0.152: v31.7,15.54 28.35,15.54 v25.3,18.59 | v56.1,59.4 56.56,59.4 62.96,53 63.9,53 65,51.9 65,51 69.06,46.94 v71.02,46.94 | v40.08,13.11 40.08,14.02 46.48,20.42 56.84,20.42 58.22,21.79 58.22,40.39 61.27,43.43 v71.02,43.43
LRCLK  (via drill 0.35)
  Top 0.152: 58.37,10.97 57.61,11.73 57.45,11.73 54.41,14.78 54.41,15.85 IC3.15 | 58.37,10.97 59.13,10.97 TP3.TP 58.37,10.97 | v37.64,5.94 36.58,7.01 36.58,7.92 IC4.4 | v57.91,9.45 58.37,9.91 58.37,10.97
  Bottom 0.152: v37.64,5.94 39.78,5.94 41.3,4.42 52.88,4.42 v57.91,9.45
MCLK  (via drill 0.35)
  Top 0.152: 55.47,14.33 57.15,12.65 60.66,12.65 62.64,10.67 63.55,10.67 64.01,10.21 TP1.TP | 55.47,14.33 55.02,14.78 IC3.16 | v41.3,10.82 40.23,10.82 38.56,9.14 38.56,8.08 IC4.7 | 55.47,14.33 v55.63,14.48
  Bottom 0.152: v41.3,10.82 51.97,10.82 v55.63,14.48
N$1  (via drill 0.35)
  Top 0.152: IC4.1 34.59,8.08 32.46,8.08 31.09,6.71 29.72,6.71 29.26,7.16 29.26,8.84 28.8,9.3 28.8,10.36 v28.96,10.52 30.02,11.58 30.02,12.19 R27.2 | v19.51,12.8 18.29,12.8 SJ10.2
  Bottom 0.152: v19.51,12.8 26.67,12.8 v28.96,10.52
N$2
  Top 0.152: C33.1 62.48,54.71 62.48,53.95 60.66,52.12 60.5,52.12 60.2,51.82 60.2,50.44 IC6.8
N$3
  Top 0.152: C33.2 64.47,54.71 64.47,52.27 64.01,51.82 64.01,50.44 IC6.5
N$4  (via drill 0.35)
  Top 0.152: C38.1 76.5,29.26 85.65,29.26 87.33,30.94 87.33,31.7 C37.2 87.33,31.85 87.33,36.27 87.63,36.58 87.63,37.34 R20.2 87.78,37.49 87.78,38.1 v87.17,38.71 | v83.36,40.39 82.3,40.39 R16.2 | v97.54,43.13 97.84,43.43 97.84,44.81 IC9.3
  Bottom 0.152: v83.36,40.39 85.5,40.39 v87.17,38.71 91.59,43.13 v97.54,43.13
N$5
  Top 0.152: C34.1 72.08,54.71 72.08,53.95 70.1,51.97 70.1,50.44 IC7.8
N$6  (via drill 0.35)
  Top 0.152: v43.13,6.71 43.13,7.92 IC4.14 | v35.2,4.42 35.2,3.2 R9.2
  Bottom 0.152: v43.13,6.71 37.49,6.71 v35.2,4.42
N$7  (via drill 0.35)
  Top 0.152: C39.2 12.8,58.22 21.49,58.22 21.95,58.67 C40.1 21.95,58.83 21.79,58.98 21.79,60.79 | 21.79,60.79 18.14,64.45 17.53,64.45 R21.1 | 21.79,60.79 21.79,62.79 22.62,63.62 30.41,63.62 | R17.2 33.09,63.62 31.87,63.62 30.41,63.62 | v86.11,46.63 86.41,46.33 86.41,44.96 IC10.2 | 30.41,63.62 v29.87,64.16
  Bottom 0.152: v86.11,46.63 85.5,46.63 67.97,64.16 v29.87,64.16
N$8  (via drill 0.35)
  Top 0.152: v39.62,16.31 39.93,16 39.93,15.09 IC4.20 | v28.19,28.04 v33.83,22.4 | v22.86,35.51 22.4,35.97 22.4,36.58 R10.1
  Bottom 0.152: v39.62,16.31 39.62,16.61 v33.83,22.4 | v28.19,28.04 28.19,30.18 v22.86,35.51
N$9  (via drill 0.35)
  Top 0.152: IC4.21 39.17,15.09 38.56,15.09 IC4.22 38.56,14.94 v38.56,13.72 | v44.2,23.62 44.2,37.19 34.44,46.94 28.8,46.94 28.35,47.4 27.89,47.4 C18.-
  Bottom 0.152: v38.56,13.72 38.56,14.33 40.23,16 40.23,19.96 43.89,23.62 v44.2,23.62
N$10  (via drill 0.35)
  Top 0.152: R24.1 10.67,63.55 10.67,62.79 12.65,60.81 12.65,60.2 C39.1 12.8,60.2 13.56,60.2 15.96,62.6 17.5,62.6 R21.2 17.53,62.62 17.68,62.77 v18.75,62.77 | v87.78,51.82 87.78,50.14 IC10.6
  Bottom 0.152: v87.78,51.82 87.78,54.41 76.42,65.77 21.75,65.77 v18.75,62.77
N$11  (via drill 0.35)
  Top 0.152: v40.54,10.21 41.15,9.6 41.15,8.08 IC4.11 | v12.19,11.28 12.19,10.06 12.34,9.91 SJ8.2 | v7.47,13.26 7.01,12.8 7.01,12.04 R26.2
  Bottom 0.152: v40.54,10.21 40.08,10.21 39.78,9.91 31.7,9.91 25.91,15.7 25.91,16 25.6,16.31 14.78,16.31 12.19,13.72 12.19,13.26 | v12.19,11.28 12.19,13.26 | 12.19,13.26 v7.47,13.26
N$12
  Top 0.152: C47.1 88.7,54.25 88.7,51.82 89,51.51 89,50.14 IC10.5
N$13
  Top 0.152: C47.2 86.72,53.03 85.19,51.51 85.19,50.14 IC10.8
N$14
  Top 0.152: C34.2 74.07,54.71 74.07,52.12 73.91,51.97 73.91,50.44 IC7.5
N$15  (via drill 0.35)
  Top 0.152: IC10.3 87.63,44.96 87.63,46.33 86.72,47.24 85.8,47.24 84.28,48.77 84.28,49.07 81.99,51.36 81.53,51.36 R18.2 81.38,51.36 81.38,50.14 v81.23,49.99 | C40.2 24.08,58.83 28.04,58.83 28.8,58.06 29.57,58.06 R22.2 29.72,58.06 30.33,58.06 49.53,38.86 58.22,38.86 C41.1 58.37,38.86 58.37,39.62 v58.83,40.08
  Bottom 0.152: v81.23,49.99 76.05,44.81 76.05,44.65 71.48,40.08 v58.83,40.08
N$16
  Top 0.152: C35.1 70.87,22.71 70.87,19.81 69.95,18.9 69.95,17.53 IC8.8
N$17
  Top 0.152: C32.2 54.71,54.71 54.71,52.43 54.1,51.82 54.1,50.44 IC5.5
N$18  (via drill 0.35)
  Top 0.152: v41.76,9.3 41.76,8.08 IC4.12 | v12.8,13.41 12.19,14.02 12.19,14.78 SJ7.2 12.34,14.94 12.34,15.7 8.99,19.05 8.53,19.05 R25.2
  Bottom 0.152: v41.76,9.3 16.92,9.3 v12.8,13.41
N$21  (via drill 0.35)
  Top 0.152: 31.24,8.69 30.79,8.23 30.33,8.23 R8.2 | 31.24,8.69 31.85,9.3 35.05,9.3 35.36,8.99 35.36,8.08 IC4.2 | v9.6,4.42 8.23,4.42 SJ9.2 | v31.39,8.08 31.39,8.53 31.24,8.69
  Bottom 0.152: v9.6,4.42 27.43,4.42 28.04,3.81 28.65,3.81 31.39,6.55 v31.39,8.08
N$22
  Top 0.152: C35.2 72.69,22.71 72.69,19.81 73.76,18.75 73.76,17.53 IC8.5
N$23
  Top 0.152: C32.1 52.73,54.71 52.73,53.95 50.9,52.12 50.75,52.12 50.44,51.82 50.44,50.44 IC5.8
N$28  (via drill 0.35)
  Top 0.152: 96.62,40.08 96.93,40.08 C36.2 96.62,40.08 | 96.62,40.08 96.32,40.08 94.03,37.8 92.51,37.8 R19.1 92.35,37.64 91.44,37.64 v90.98,37.19 | 96.62,40.08 96.62,44.81 IC9.2 | v25.45,8.69 24.08,8.69 R15.2 | v85.34,30.33 85.34,31.7 C37.1
  Bottom 0.152: v25.45,8.69 43.89,8.69 45.41,10.21 65.23,10.21 v85.34,30.33 90.98,35.97 v90.98,37.19
N$30
  Top 0.152: R19.2 92.51,35.97 96.47,35.97 96.77,36.27 R23.1 96.93,36.42 96.93,37.19 98.75,39.01 98.75,40.08 C36.1 98.91,40.23 98.91,41 99.97,42.06 99.97,46.33 97.84,48.46 97.84,49.99 IC9.6
N$32
  Top 0.152: C46.1 98.3,54.25 98.3,52.27 99.06,51.51 99.06,50.14 IC9.5
N$33
  Top 0.152: C46.2 96.47,54.25 96.47,52.73 95.25,51.51 95.25,50.14 IC9.8
N$39
  Top 0.152: R1.2 19.05,3.81 22.1,3.81 C11.1
N$40  (via drill 0.35)
  Top 0.152: v65.84,9.91 65.84,10.97 60.81,16 57.76,16 IC3.20 | v25.45,3.5 24.38,3.5 24.23,3.66 C11.2
  Bottom 0.152: v65.84,9.91 59.28,9.91 52.88,3.5 v25.45,3.5
N$43  (via drill 0.35)
  Top 0.152: IC3.10 51.66,23.16 48.77,20.27 48.77,12.95 47.09,11.28 Q1.1 46.94,11.28 46.94,10.82 v45.72,9.6 | v41.6,5.03 41.15,4.57 41.15,3.81 C13.2
  Bottom 0.152: v41.6,5.03 42.37,5.03 45.72,8.38 v45.72,9.6
N$44
  Top 0.152: 48.16,8.53 47.4,7.77 47.09,7.77 Q1.2 | 48.16,8.53 49.38,9.75 49.38,13.56 51.66,15.85 IC3.11 | 48.16,8.53 49.07,7.62 49.68,7.62 52.27,5.03 52.27,2.74 51.66,2.13 49.84,2.13 48.16,3.81 46.48,3.81 C12.2
N$45  (via drill 0.35)
  Top 0.152: v55.63,21.95 55.63,23.16 IC3.4 | 30.63,20.27 30.18,19.81 30.18,19.36 R2.1 | 30.63,20.27 v32.31,21.95 | v19.51,17.83 18.29,17.83 SJ1.2 | 30.63,20.27 v30.48,20.42
  Bottom 0.152: v55.63,21.95 48.16,21.95 45.26,24.84 35.2,24.84 v32.31,21.95 | v19.51,17.83 23.62,17.83 26.21,20.42 v30.48,20.42
N$46  (via drill 0.35)
  Top 0.152: IC3.1 57.61,23.32 57.61,24.08 57.76,24.23 55.63,26.36 v55.63,28.35 55.63,28.96 54.41,30.18 54.41,30.79 R4.1 | v42.22,28.35 42.06,28.19 41.15,28.19 SJ3.2
  Bottom 0.152: v55.63,28.35 v42.22,28.35
N$47  (via drill 0.35)
  Top 0.152: IC3.2 57,23.16 v57,21.95 57.15,21.79 57.91,21.79 58.37,22.25 58.37,33.22 55.17,36.42 53.03,36.42 52.43,35.81 52.43,35.2 R6.1 | v37.03,24.23 35.97,24.23 SJ5.2
  Bottom 0.152: v37.03,24.23 45.41,24.23 48.31,21.34 56.39,21.34 v57,21.95
N$48  (via drill 0.35)
  Top 0.152: v53.95,25.15 54.41,24.69 54.41,23.32 IC3.6 | v23.77,30.48 23.77,27.28 15.7,19.2 15.7,18.9 14.94,18.14 14.33,18.14 | 14.33,18.14 14.17,18.14 SJ6.2 14.33,18.14 | v28.35,4.42 28.35,3.2 R7.1 | v13.41,11.89 15.09,13.56 15.09,16.92 14.33,17.68 14.33,18.14
  Bottom 0.152: v53.95,25.15 46.33,25.15 44.35,27.13 36.58,27.13 36.27,27.43 26.82,27.43 v23.77,30.48 | v28.35,4.42 27.89,4.42 23.32,8.99 16.31,8.99 v13.41,11.89
N$51  (via drill 0.35)
  Top 0.152: v55.02,24.54 55.02,23.32 IC3.5 | v47.24,24.54 46.48,23.77 46.48,23.16 R5.1 | v35.97,26.82 35.97,28.04 SJ4.2
  Bottom 0.152: v55.02,24.54 v47.24,24.54 46.48,24.54 44.2,26.82 v35.97,26.82
N$52  (via drill 0.35)
  Top 0.152: IC3.3 56.39,23.32 56.39,24.23 v55.02,25.6 54.41,26.21 54.41,26.82 R3.1 | v42.98,27.74 41.15,25.91 41.15,24.23 SJ2.2
  Bottom 0.152: v42.98,27.74 52.88,27.74 v55.02,25.6
OUT-CHANNEL-L
  Top 0.152: R23.2 98.75,36.27 98.75,33.22 99.21,32.77 99.21,30.33 97.38,28.5 97.38,23.62 96.16,22.4 96.16,22.1 BU2.3
OUT-CHANNEL-R  (via drill 0.35)
  Top 0.152: v8.69,62.18 8.69,63.55 R24.2
  Bottom 0.152: v8.69,62.18 8.69,38.71 13.87,33.53 BU3.3
VOUTL+  (via drill 0.35)
  Top 0.152: 11.43,49.38 11.43,49.53 10.97,49.99 10.97,50.75 C29.2 | 11.43,49.38 11.43,45.11 R12.2 | v75.29,44.81 79.55,40.54 80.16,40.54 R16.1 | v63.09,52.12 62.79,51.82 62.79,50.44 IC6.6 | 11.43,49.38 15.09,49.38 19.36,53.65 v19.51,53.65
  Bottom 0.152: v75.29,44.81 70.41,44.81 v63.09,52.12 61.57,53.65 v19.51,53.65
VOUTL-  (via drill 0.35)
  Top 0.152: v28.35,14.17 24.84,10.67 24.08,10.67 R15.1 | v34.75,17.68 35.2,18.14 35.2,18.9 R11.2 35.36,19.05 35.36,19.66 37.34,21.64 38.25,21.64 | 38.25,21.64 42.06,21.64 C28.2 | v52.88,52.12 52.88,50.44 IC5.6 | 38.25,21.64 v38.25,27.74
  Bottom 0.152: v28.35,14.17 31.24,14.17 v34.75,17.68 | v52.88,52.12 52.88,45.57 38.25,30.94 v38.25,27.74
VOUTR+  (via drill 0.35)
  Top 0.152: C31.2 80.31,45.72 v80.31,47.24 80.31,49.84 79.55,50.6 79.55,51.36 R18.1 | v25.3,15.7 24.08,15.7 R14.2 | v72.39,19.05 72.39,17.53 IC8.6
  Bottom 0.152: v25.3,15.7 31.39,9.6 41.15,9.6 42.06,10.52 65.08,10.52 72.39,17.83 v72.39,19.05 80.31,26.98 v80.31,47.24
VOUTR-  (via drill 0.35)
  Top 0.152: v24.08,22.25 24.08,21.03 R13.2 | v72.54,52.12 72.54,50.44 IC7.6 | v57.93,59.4 55.32,62.01 55.32,62.77 C30.2 55.17,62.92 55.17,63.68 52.71,66.14 37.61,66.14 R17.1 35.08,62.08 34.25,61.25 v30.46,61.25
  Bottom 0.152: v24.08,22.25 24.08,28.35 8.99,43.43 8.99,44.04 26.19,61.25 v30.46,61.25 | v72.54,52.12 67.21,52.12 59.93,59.4 v57.93,59.4

### Text on the board
tPlace: Powered by azozrazoz